# EAGLE design mainv2 (EAGLE 9.6.2)
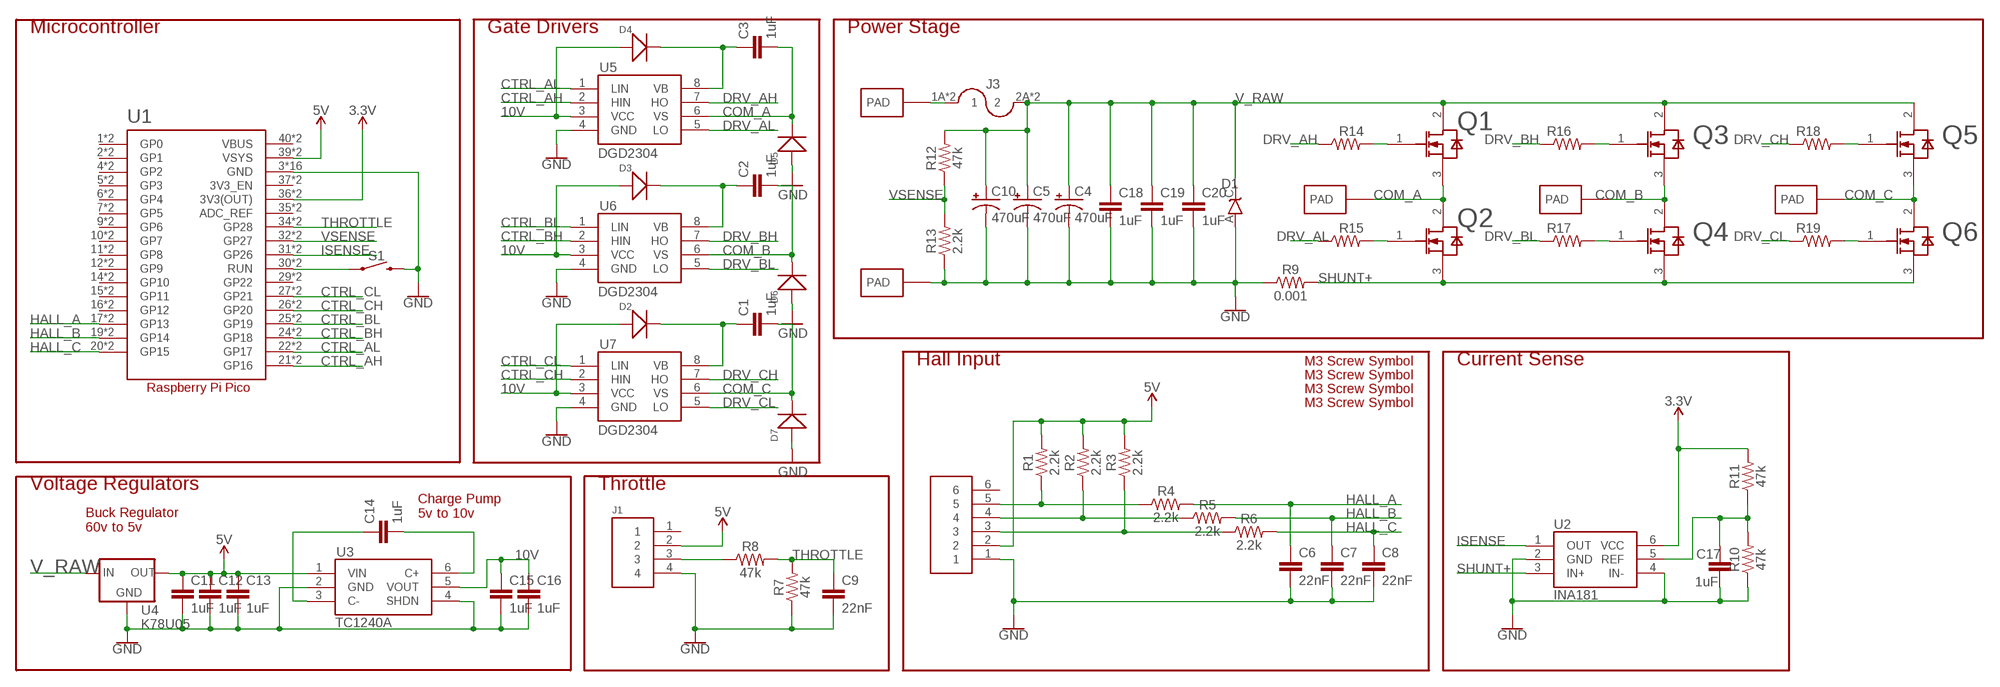
[diagram p0: schematic, sheet 1]

## Parts
C1  1uF  1.0UF-1206-50V-10%  [1206]
C2  1uF  1.0UF-1206-50V-10%  [1206]
C3  1uF  1.0UF-1206-50V-10%  [1206]
C4  470uF  1000UF-RADIAL-5MM-25V-20%  [CPOL-RADIAL-5MM-10MM]
C5  470uF  1000UF-RADIAL-5MM-25V-20%  [CPOL-RADIAL-5MM-10MM]
C6  22nF  1.0UF-1206-50V-10%  [1206]
C7  22nF  1.0UF-1206-50V-10%  [1206]
C8  22nF  1.0UF-1206-50V-10%  [1206]
C9  22nF  1.0UF-1206-50V-10%  [1206]
C10  470uF  1000UF-RADIAL-5MM-25V-20%  [CPOL-RADIAL-5MM-10MM]
C11  1uF  1.0UF-1206-50V-10%  [1206]
C12  1uF  1.0UF-1206-50V-10%  [1206]
C13  1uF  1.0UF-1206-50V-10%  [1206]
C14  1uF  1.0UF-1206-50V-10%  [1206]
C15  1uF  1.0UF-1206-50V-10%  [1206]
C16  1uF  1.0UF-1206-50V-10%  [1206]
C17  1uF  1.0UF-1206-50V-10%  [1206]
C18  1uF  1.0UF-1206-50V-10%  [1206]
C19  1uF  1.0UF-1206-50V-10%  [1206]
C20  1uF  1.0UF-1206-50V-10%  [1206]
D1  TVS  TVS_UNIDO-214AC  [DO-214AC]
D2  SMD-DIODE-100V-200MA(SOD-123)  [SOD-123]
D3  SMD-DIODE-100V-200MA(SOD-123)  [SOD-123]
D4  SMD-DIODE-100V-200MA(SOD-123)  [SOD-123]
D5  SMD-DIODE-100V-200MA(SOD-123)  [SOD-123]
D6  SMD-DIODE-100V-200MA(SOD-123)  [SOD-123]
D7  SMD-DIODE-100V-200MA(SOD-123)  [SOD-123]
J1  HEADER4VALULOK  [4PINVALULOK]
J2  HEADER6  [6PINVALULOK]
J3  FUSE  [AUTO_FUSE]
Q1  IRF135S203  [TO254P1524X508-4_3N]
Q2  IRF135S203  [TO254P1524X508-4_3N]
Q3  IRF135S203  [TO254P1524X508-4_3N]
Q4  IRF135S203  [TO254P1524X508-4_3N]
Q5  IRF135S203  [TO254P1524X508-4_3N]
Q6  IRF135S203  [TO254P1524X508-4_3N]
R1  2.2k  RESISTOR1206  [1206]
R2  2.2k  RESISTOR1206  [1206]
R3  2.2k  RESISTOR1206  [1206]
R4  2.2k  RESISTOR1206  [1206]
R5  2.2k  RESISTOR1206  [1206]
R6  2.2k  RESISTOR1206  [1206]
R7  47k  RESISTOR1206  [1206]
R8  47k  RESISTOR1206  [1206]
R9  0.001  RESISTOR  [R2512]
R10  47k  RESISTOR1206  [1206]
R11  47k  RESISTOR1206  [1206]
R12  47k  RESISTOR1206  [1206]
R13  2.2k  RESISTOR1206  [1206]
R14  R-US_R1206  [R1206]
R15  R-US_R1206  [R1206]
R16  R-US_R1206  [R1206]
R17  R-US_R1206  [R1206]
R18  R-US_R1206  [R1206]
R19  R-US_R1206  [R1206]
S1  MOMENTARY-SWITCH-SPST-PTH-6.0MM  [TACTILE_SWITCH_PTH_6.0MM]
U1  RASPBERRY_PICO-NO_DEBUG  [PICO-PKG-NO_DEBUG]
U2  INA181  [SOT23-6]
U3  TC1240A  [SOT23-6]
U4  K78U05  V_REG_78XX  [V78W_BACKWARDS]
U5  DGD2304  [SOIC8]
U6  DGD2304  [SOIC8]
U7  DGD2304  [SOIC8]
U$4  PAD  [PAD]
U$5  PAD  [PAD]
U$6  PAD  [PAD]
U$7  PAD  [PAD]
U$8  PAD  [PAD]
U$10  SCREW  [M3HOLE]
U$11  SCREW  [M3HOLE]
U$12  SCREW  [M3HOLE]
U$13  SCREW  [M3HOLE]

## Nets
3.3V: R11.2 U1.36(3V3(OUT)) U1.P$36(3V3(OUT)) U2.6(VCC)
5V: C11.1 C12.1 C13.1 J1.2 J2.2 R1.2 R2.2 R3.2 U1.39(VSYS) U1.P$39(VSYS) U3.1(VIN) U4.OUT
10V: C15.1 C16.1 D2.+ D3.+ D4.+ U3.5(VOUT) U5.3(VCC) U6.3(VCC) U7.3(VCC)
COM_A: C3.2 D5.- Q1.3(SOURCE) Q2.2(DRAIN) U5.6(VS) U$6.PAD
COM_B: C2.2 D6.- Q3.3(SOURCE) Q4.2(DRAIN) U6.6(VS) U$7.PAD
COM_C: C1.2 D7.- Q5.3(SOURCE) Q6.2(DRAIN) U7.6(VS) U$8.PAD
CTRL_AH: U1.21(GP16) U1.P$21(GP16) U5.2(HIN)
CTRL_AL: U1.22(GP17) U1.P$22(GP17) U5.1(LIN)
CTRL_BH: U1.24(GP18) U1.P$24(GP18) U6.2(HIN)
CTRL_BL: U1.25(GP19) U1.P$25(GP19) U6.1(LIN)
CTRL_CH: U1.26(GP20) U1.P$26(GP20) U7.2(HIN)
CTRL_CL: U1.27(GP21) U1.P$27(GP21) U7.1(LIN)
DRV_AH: R14.1 U5.7(HO)
DRV_AL: R15.1 U5.5(LO)
DRV_BH: R16.1 U6.7(HO)
DRV_BL: R17.1 U6.5(LO)
DRV_CH: R18.1 U7.7(HO)
DRV_CL: R19.1 U7.5(LO)
GND: C4.- C5.- C6.2 C7.2 C8.2 C9.2 C10.- C11.2 C12.2 C13.2 C15.2 C16.2 C17.2 C18.2 C19.2 C20.2 D1.A D5.+ D6.+ D7.+ J1.4 J2.1 R7.1 R9.1 R10.1 R13.1 S1.3 U1.3(GND) U1.8(GND) U1.13(GND) U1.18(GND) U1.23(GND) U1.28(GND) U1.33(GND) U1.38(GND) U1.P$3(GND) U1.P$8(GND) U1.P$13(GND) U1.P$18(GND) U1.P$23(GND) U1.P$28(GND) U1.P$33(GND) U1.P$38(GND) U2.2(GND) U2.4(IN-) U3.2(GND) U3.4(SHDN) U4.GND U5.4(GND) U6.4(GND) U7.4(GND) U$5.PAD
HALL_A: C6.1 R4.2 U1.17(GP13) U1.P$17(GP13)
HALL_B: C7.1 R5.2 U1.19(GP14) U1.P$19(GP14)
HALL_C: C8.1 R6.2 U1.20(GP15) U1.P$20(GP15)
ISENSE: U1.31(GP26) U1.P$31(GP26) U2.1(OUT)
N$1: C2.1 D3.- U6.8(VB)
N$2: J2.3 R3.1 R6.1
N$3: C3.1 D4.- U5.8(VB)
N$4: J2.4 R2.1 R5.1
N$5: Q3.1(GATE) R16.2
N$6: J2.5 R1.1 R4.1
N$7: J1.3 R8.1
N$8: C1.1 D2.- U7.8(VB)
N$9: S1.1 U1.30(RUN) U1.P$30(RUN)
N$10: C17.1 R10.2 R11.1 U2.5(REF)
N$11: Q5.1(GATE) R18.2
N$12: Q1.1(GATE) R14.2
N$13: Q2.1(GATE) R15.2
N$14: Q4.1(GATE) R17.2
N$15: Q6.1(GATE) R19.2
N$18: C14.1 U3.3(C-)
N$19: C14.2 U3.6(C+)
SHUNT+: Q2.3(SOURCE) Q4.3(SOURCE) Q6.3(SOURCE) R9.2 U2.3(IN+)
THROTTLE: C9.1 R7.2 R8.2 U1.34(GP28) U1.P$34(GP28)
V_PREFUSE: J3.1A J3.1B U$4.PAD
V_RAW: C4.+ C5.+ C10.+ C18.1 C19.1 C20.1 D1.C J3.2A J3.2B Q1.2(DRAIN) Q3.2(DRAIN) Q5.2(DRAIN) R12.2 U4.IN
VSENSE: R12.1 R13.2 U1.32(GP27) U1.P$32(GP27)
Unconnected: J1.1 J2.6 U1.1(GP0) U1.2(GP1) U1.4(GP2) U1.5(GP3) U1.6(GP4) U1.7(GP5) U1.9(GP6) U1.10(GP7) U1.11(GP8) U1.12(GP9) U1.14(GP10) U1.15(GP11) U1.16(GP12) U1.29(GP22) U1.35(ADC_REF) U1.37(3V3_EN) U1.P$1(GP0) U1.P$2(GP1) U1.P$4(GP2) U1.P$5(GP3) U1.P$6(GP4) U1.P$7(GP5) U1.P$9(GP6) U1.P$10(GP7) U1.P$11(GP8) U1.P$12(GP9) U1.P$14(GP10) U1.P$15(GP11) U1.P$16(GP12) U1.P$29(GP22) U1.P$35(ADC_REF) U1.P$37(3V3_EN)

## Notes on the sheet
- Microcontroller | Gate Drivers | Power Stage
- Hall Input | Current Sense
- Voltage Regulators | Throttle
- Charge Pump
  5v to 10v
- Buck Regulator
  60v to 5v

## Power pins joined to a net without a drawn wire
VBUS: U1.40(VBUS) U1.P$40(VBUS)

## Library data of the parts
C1-C3 C6-C9 C11-C20 = SparkFun-Capacitors:1.0UF: 1µF ceramic capacitors A capacitor is a passive two-terminal electrical component used to store electrical energy temporarily in an electric field.; PROD_ID: CAP-09822; VALUE: 1.0uF
C4 C5 C10 = SparkFun-Capacitors:1000UF: 1,000µF/1mF ceramic capacitors A capacitor is a passive two-terminal electrical component used to store electrical energy temporarily in an electric field. CAP-08070; PROD_ID: CAP-09538; VALUE: 1mF
D1 = 2018:TVS_UNI
D2-D7 = Seeed-Diode:SMD-DIODE-100V-200MA(SOD-123): 304010007; MPN: MMSD4148; VALUE: MMSD4148-sod123
J1 = Custom_old:HEADER4
J2 = Custom_old:HEADER6
J3 = Custom_old:FUSE
Q1-Q6 = IRF135S203:IRF135S203: IRF135S203 TO254P1524X508-4_3N Insulated-Gate Field-Effect Transistor (IGFET), N-Channel, Enhancement, Body Diode, Pin 1 Gate, 2 Drain, 3 Source, 3 Pins
R1-R8 R10-R13 = SparkFun-Resistors:RESISTOR: Generic Resistor Package
R9 = Custom_old:RESISTOR
R14-R19 = rcl:R-US_: RESISTOR, American symbol; SPICEPREFIX: R
S1 = SparkFun-Switches:MOMENTARY-SWITCH-SPST: Momentary Switch (Pushbutton) - SPST Normally-open (NO) SPST momentary switches (buttons, pushbuttons). Variants PTH-12MM - 12mm square, through-hole Momentary Pushbutton Switch - 12mm Square <https://www.sparkfun.com/products/9190> (COM-09190) PTH-6.0MM, PTH-6.0MM-KIT - 6.0mm square, through-hole Mini Pushbutton Switch <https://www.sparkfun.com/products/97> (COM-00097) KIT package intended for soldering kit's - only one side of pads' copper is exposed. PTH-RIGHT-ANGLE-KIT - Right-angle, through-hole Right Angle Tactile Button <https://www.sparkfun.com/products/10791> - Used on SparkFun BigTime Watch Kit <https://www.sparkfun.com/products/11734> SMD-12MM - 12mm square, surface-mount Tactile Button - SMD (12mm) <https://www.sparkfun.com/products/12993> (COM-12993) Used on SparkFun PicoBoard <https://www.sparkfun.com/products/11888> SMD-4.5MM - 4.5mm Square Trackball Switch Used on SparkFun Blackberry Trackballer Breakout <https://www.sparkfun.com/products/13169> SMD-4.6MMX2.8MM - 4.60mm x 2.80mm, surface mount Used on SparkFun SAMD21 Mini Breakout <https://www.sparkfun.com/products/13664> SMD-5.2MM, SMD-5.2-REDUNDANT - 5.2mm square, surface-mount Mini Pushbutton Switch - SMD <https://www.sparkfun.com/products/8720> (COM-08720) Used on Arduino Pro Mini <https://www.sparkfun.com/products/11114> REDUNDANT package connects both switch circuits together SMD-6.0X3.5MM - 6.0 x 3.5mm, surface mount Momentary Reset Switch SMD <https://www.sparkfun.com/products/8229> (COM-08229) SMD-6.2MM-TALL - 6.2mm square, surface mount Tactile Button - SMD (6mm) <https://www.sparkfun.com/products/12992> Used on SparkFun Digital Sandbox <https://www.sparkfun.com/products/12651> SMD-RIGHT-ANGLE - Right-angle, surface mount Used on SparkFun Block for Intel® Edison - Arduino <https://www.sparkfun.com/products/13036>; PROD_ID: SWCH-08441; SF_SKU: COM-00097
U1 = RpiPico:RASPBERRY_PICO-NO_DEBUG
U2 = Custom_old:INA181
U3 = Custom_old:TC1240A
U4 = 2018:V_REG_78XX: Voltage Regulator Standard 7805 5V regulator. IGO (Input Ground Output). Spark Fun Electronics SKU : COM-00107
U5-U7 = Custom_old:DGD2304
U$4-U$8 = Custom_old:PAD
U$10-U$13 = Custom_old:SCREW

## Net classes
0 default: clearance 0.205 mm

## Board
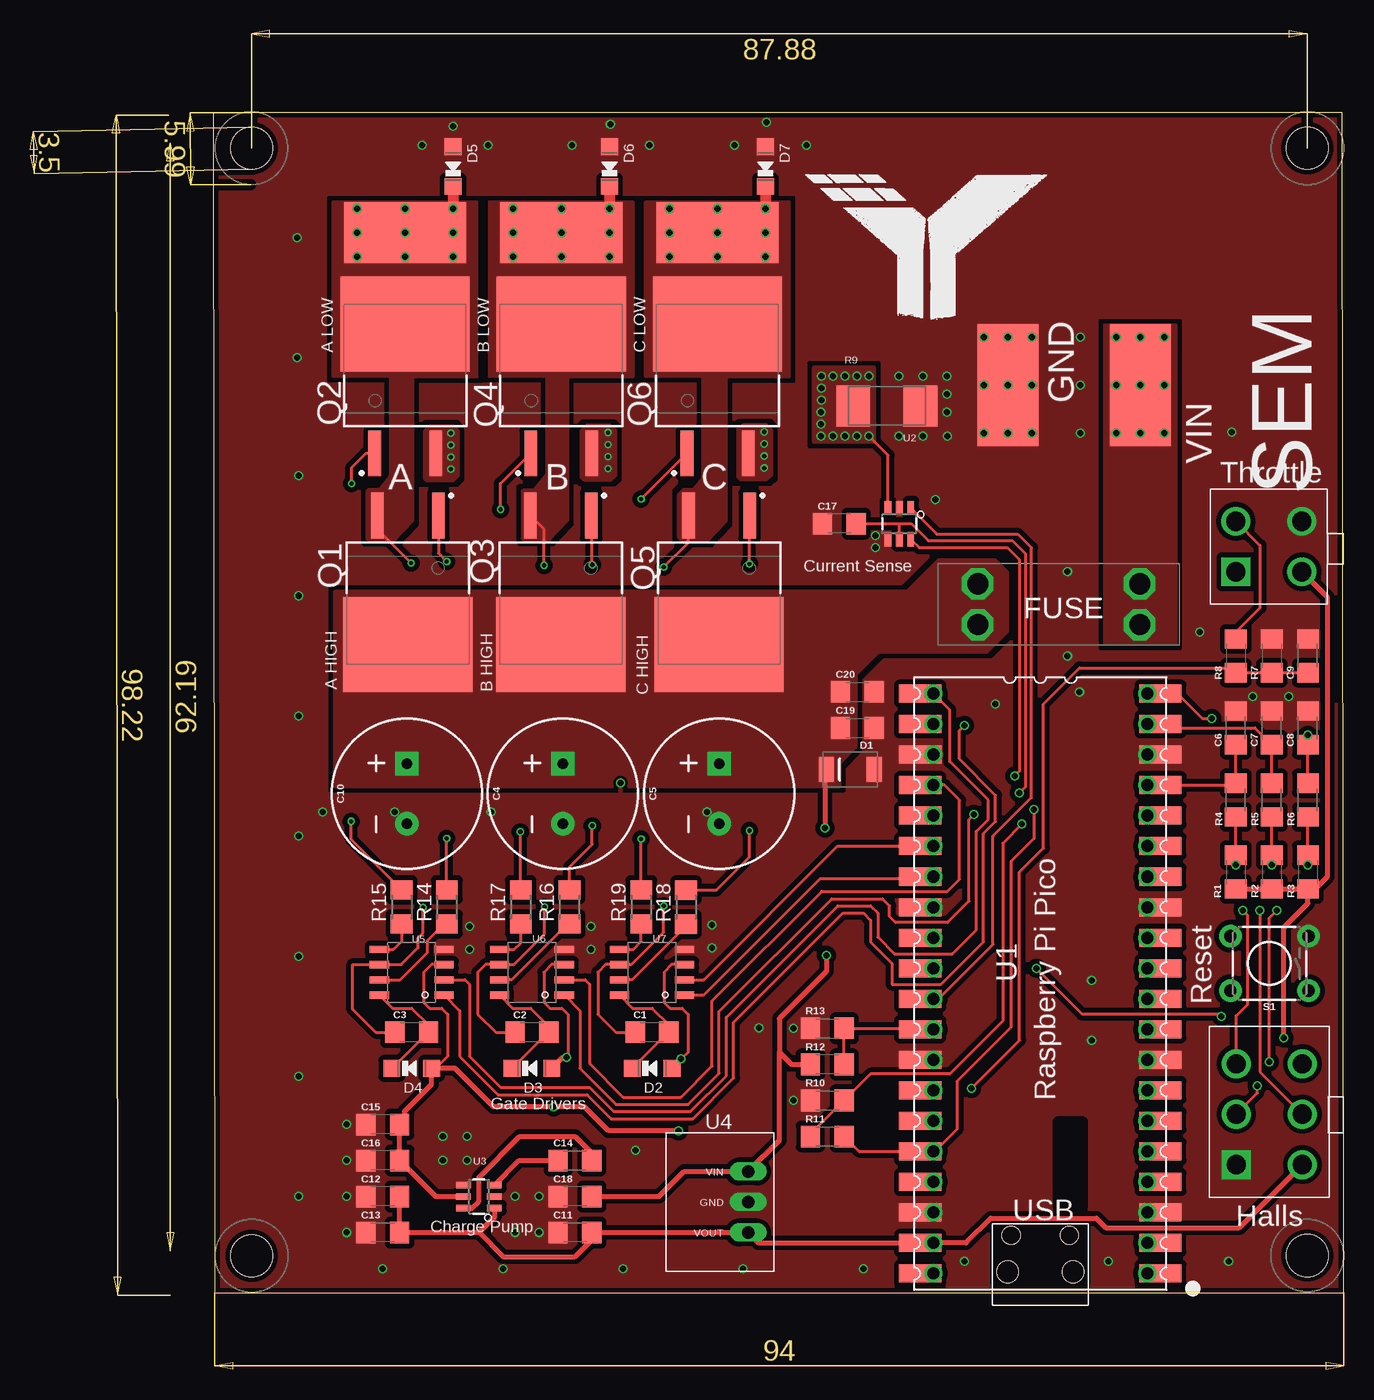
[diagram p1: board, top side]
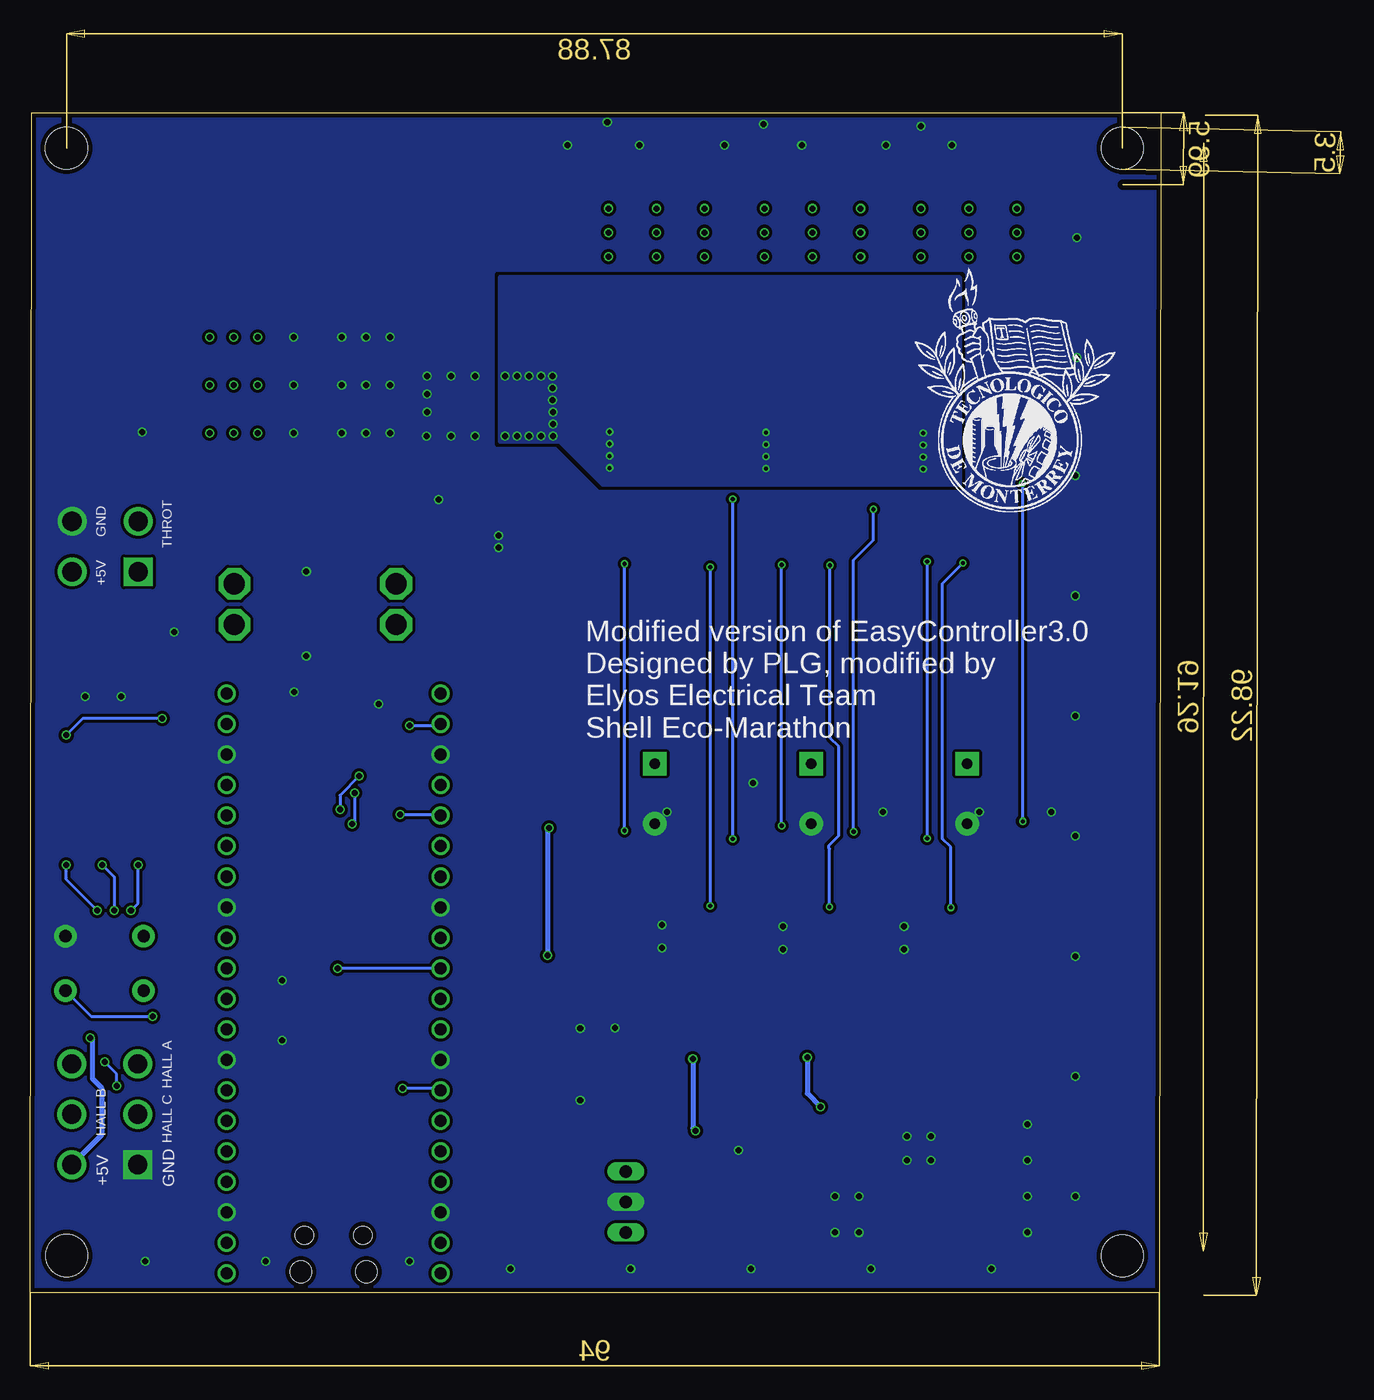
[diagram p2: board, bottom side, seen from below]

Size 94.12 x 98.22 mm. Coordinates in mm from the lower left corner, seen from the top.
Outline: 0.12,0 94.12,0 94,98.22 0,98.22 0.12,0
Copper layers (1*16): Top 0.035559375mm / dielectric 1.6mm / Bottom 0.035559375mm
Design rules "jlcpcb2layer *": minimum track width 6mil, minimum drill 10mil, track to track 5mil, track to pad 6mil, pad to pad 6mil, via to via 6mil, smd to smd 6mil, copper to edge 15mil, drill to drill 6mil, minimum pad ring 5mil, minimum via ring 5mil, stop-mask expansion 2.5mil, vias tented up to drill 25mil, thermal gap 10mil
Milling: area 129.4,61.5 to 134.8,61.6

### Footprints (pad centres in the part's own frame; a part is rotated, then mirrored left to right if it is on the bottom)
1206 = smd 1.6 x 1.8: 1 -1.4,0; 2 1.4,0
CPOL-RADIAL-5MM-10MM = drill 0.9 pad 1.93 square: + 2.5,0 | drill 0.9 pad 1.93: - -2.5,0
DO-214AC = smd 1.27 x 2.1: A 1.985,0; C -1.985,0
SOD-123 = smd 1.397 x 1.397: + -1.651,0; - 1.651,0
4PINVALULOK = drill 1.6 square: 1 0,5.5 | drill 1.6: 2 0,0; 3 4.2,5.5; 4 4.2,0
6PINVALULOK = drill 1.6 square: 1 -6.35,2.96 | drill 1.6: 2 -6.35,-2.54; 3 -2.15,2.96; 4 -2.15,-2.54; 5 2.05,2.96; 6 2.05,-2.54
AUTO_FUSE = drill 1.75 octagon: 1A 0,3.4; 1B 0,0; 2A 13.47,3.4; 2B 13.47,0
TO254P1524X508-4_3N = smd 3.8 x 1.05: 1 -5.375,2.54; 3 -5.375,-2.54 | smd 7.9 x 10.75: 2 5.375,0
R2512 = smd 2.8 x 3.4: 1 -2.8,0; 2 2.8,0
R1206 = smd 1.6 x 1.803: 1 -1.422,0; 2 1.422,0
TACTILE_SWITCH_PTH_6.0MM = drill 1.016 pad 1.88: 1 -3.251,2.261; 2 3.251,2.261; 3 -3.251,-2.261; 4 3.251,-2.261
PICO-PKG-NO_DEBUG = drill 1: 1 -7.62,25.4; 2 -7.62,22.86; 3 -7.62,20.32; 4 -7.62,17.78; 5 -7.62,15.24; 6 -7.62,12.7; 7 -7.62,10.16; 8 -7.62,7.62; 9 -7.62,5.08; 10 -7.62,2.54; 11 -7.62,0; 12 -7.62,-2.54; 13 -7.62,-5.08; 14 -7.62,-7.62; 15 -7.62,-10.16; 16 -7.62,-12.7; 17 -7.62,-15.24; 18 -7.62,-17.78; 19 -7.62,-20.32; 20 -7.62,-22.86; 21 10.16,-22.86; 22 10.16,-20.32; 23 10.16,-17.78; 24 10.16,-15.24; 25 10.16,-12.7; 26 10.16,-10.16; 27 10.16,-7.62; 28 10.16,-5.08; 29 10.16,-2.54; 30 10.16,0; 31 10.16,2.54; 32 10.16,5.08; 33 10.16,7.62; 34 10.16,10.16; 35 10.16,12.7; 36 10.16,15.24; 37 10.16,17.78; 38 10.16,20.32; 39 10.16,22.86; 40 10.16,25.4 | smd 3.5 x 1.5: P$1 -8.73,25.4; P$2 -8.73,22.86; P$3 -8.73,20.32; P$4 -8.73,17.78; P$5 -8.73,15.24; P$6 -8.73,12.7; P$7 -8.73,10.16; P$8 -8.73,7.62; P$9 -8.73,5.08; P$10 -8.73,2.54; P$11 -8.73,0; P$12 -8.73,-2.54; P$13 -8.73,-5.08; P$14 -8.73,-7.62; P$15 -8.73,-10.16; P$16 -8.73,-12.7; P$17 -8.73,-15.24; P$18 -8.73,-17.78; P$19 -8.73,-20.32; P$20 -8.73,-22.86; P$21 11.27,-22.86; P$22 11.27,-20.32; P$23 11.27,-17.78; P$24 11.27,-15.24; P$25 11.27,-12.7; P$26 11.27,-10.16; P$27 11.27,-7.62; P$28 11.27,-5.08; P$29 11.27,-2.54; P$30 11.27,0; P$31 11.27,2.54; P$32 11.27,5.08; P$33 11.27,7.62; P$34 11.27,10.16; P$35 11.27,12.7; P$36 11.27,15.24; P$37 11.27,17.78; P$38 11.27,20.32; P$39 11.27,22.86; P$40 11.27,25.4 | hole 1.8: -1.455,25.27; 3.995,25.27 | hole 1.5: -1.155,22.24; 3.695,22.24
SOT23-6 = smd 0.55 x 1.2: 1 -0.95,-1.3; 2 0,-1.3; 3 0.95,-1.3; 4 0.95,1.3; 5 0,1.3; 6 -0.95,1.3
V78W_BACKWARDS = drill 1.016 long: GND 0,-3.81; IN 2.54,-3.81; OUT -2.54,-3.81
SOIC8 = smd 1.6 x 0.6: 1 -2.7,1.905; 2 -2.7,0.635; 3 -2.7,-0.635; 4 -2.7,-1.905; 5 2.7,-1.905; 6 2.7,-0.635; 7 2.7,0.635; 8 2.7,1.905
PAD = smd 10.16 x 5.08: PAD 0,0
M3HOLE = hole 3.5: 0,0

### Placement (x,y rotation side)
C1  36.53,21.67 180 top
C2  26.53,21.67 180 top
C3  16.53,21.67 180 top
C4  29.11,41.53 90 top
C5  42.12,41.53 90 top
C6  85.12,47 90 top
C7  88.12,47 90 top
C8  91.12,47 90 top
C9  91.12,53 90 top
C10  16.13,41.53 90 top
C11  30.12,5 180 top
C12  14.12,8 180 top
C13  14.12,5 180 top
C14  30.12,11 0 top
C15  14.12,14 180 top
C16  14.12,11 180 top
C17  52.12,64 180 top
C18  30.12,8 180 top
C19  53.62,47 0 top
C20  53.62,50 0 top
D1  53.03,43.55 0 top
D2  36.53,18.67 180 top
D3  26.53,18.67 180 top
D4  16.53,18.67 180 top
D5  19.97,93.73 270 top
D6  33,93.73 270 top
D7  45.97,93.73 270 top
J1  90.62,60 90 top
J2  88.12,17 90 top
J3  77.12,59 180 top
Q1  16.21,59.31 270 top
Q2  15.98,75.24 90 top
Q3  28.94,59.31 270 top
Q4  28.98,75.24 90 top
Q5  42.11,59.31 270 top
Q6  41.98,75.24 90 top
R1  85.12,35 270 top
R2  88.12,35 270 top
R3  91.12,35 270 top
R4  85.12,41 90 top
R5  88.12,41 90 top
R6  91.12,41 90 top
R7  88.12,53 270 top
R8  85.12,53 270 top
R9  56.08,73.79 180 top
R10  51.12,16 0 top
R11  51.12,13 0 top
R12  51.12,19 180 top
R13  51.12,22 0 top
R14  19.45,32.11 90 top
R15  15.7,32.11 90 top
R16  29.66,32.11 90 top
R17  25.6,32.11 90 top
R18  39.37,32.08 90 top
R19  35.63,32.11 90 top
S1  87.92,27.4 180 top
U1  70.12,27 180 top
U2  57.12,64 180 top
U3  22.12,8 90 top
U4  40.72,7.54 90 top
U5  16.53,26.67 180 top
U6  26.53,26.67 180 top
U7  36.53,26.67 180 top
U$4  77.17,75.54 90 top
U$5  66.17,75.54 270 top
U$6  15.98,88.24 0 top
U$7  28.98,88.24 0 top
U$8  41.98,88.24 0 top
U$10  91.08,95.25 0 top
U$11  91.07,3.09 0 top
U$12  3.21,3.06 0 top
U$13  3.2,95.25 0 top

### Tracks (layer width: path | path; a pad name or v marks a point on that pad's centre or on a via)
3.3V  (via drill 0.5)
  Top 0.254: U2.6 58.77,62 66.12,62 67.12,61 67.12,43.4 v66.72,43 | v68.32,40.2 68.32,37.8 66.41,35.89 66.41,22.09 61.92,17.6 61.92,13.6 60.08,11.76 U1.36 | R11.2 53.76,11.76 U1.36 | U1.P$36 U1.36
  Bottom 0.254: v66.72,43 68.32,41.4 v68.32,40.2
5V  (via drill 0.5)
  Top 0.406: J2.2 85.41,5.4 74.32,5.4 73.52,6.2 64.72,6.2 62.66,4.14 U1.39 | R1.2 R2.2 R3.2 | R3.2 91.12,32.4 89.12,30.4 v89.12,21.2 | J1.2 92.72,57.9 92.72,34.6 91.72,33.6 R3.2 | C12.1 C13.1 22.12,5 | 22.12,5 24.12,3 30.12,3 31.52,4.4 C11.1 U4.OUT 45.4,4.14 U1.39 | U3.1 23.42,6.3 22.12,5 | U1.P$39 U1.39
  Bottom 0.406: J2.2 88.12,13.19 88.12,17 88.92,17.8 88.92,21.2 v89.12,21.2
10V  (via drill 0.5)
  Top 0.254: U6.3 28.17,27.3 27.53,26.67 27.53,24.17 28.03,23.67 29.03,23.67 29.53,23.17 29.53,19.67 v29.43,19.57 | U5.3 18.17,27.3 17.53,26.67 17.53,24.17 18.03,23.67 19.03,23.67 19.53,23.17 19.53,19.67 18.53,18.67 D4.+ | U7.3 38.17,27.3 37.53,26.67 37.53,24.17 38.03,23.67 39.03,23.67 39.53,23.17 39.53,20.02 v38.96,19.44
  Top 0.406: U3.5 18.52,8 C16.1 C15.1 15.93,14.41 15.93,15.07 18.18,17.32 D4.+ | D3.+ 29.08,19.57 v29.43,19.57 | 18.53,18.67 20.13,18.67 23.33,15.47 v28.33,15.47 30.93,15.47 32.93,13.47 v38.73,13.47 | D2.+ v38.96,19.44
  Bottom 0.406: v29.43,19.57 29.43,16.57 v28.33,15.47 | v38.96,19.44 38.96,13.69 v38.73,13.47
COM_A  (via drill 0.35, 0.5)
  Top 0.254: C3.2 13.53,21.67 11.62,23.58 11.62,27.3 U5.6 15.65,27.3 17.07,28.72 17.07,29.54 17.48,29.95 v17.48,32.05 | v16.47,60.72 13.67,63.52 Q1.3
  Top 0.914: D5.- 19.97,90.25 v19.98,90.24
  Bottom 0.254: v17.48,32.05 17.48,37.08 18.16,37.77 18.16,59.02 v16.47,60.72
  other vias: 15.98,88.24 11.98,90.24 11.98,88.24 11.98,86.24 15.98,86.24 15.98,90.24 19.98,88.24 19.98,86.24
  pour Top (isolate 0.406, rank 2, no thermals): 13.87,66.84 12.9,66.84 12.79,66.73 12.79,62.75 12.95,62.59 15.06,62.59 16.64,64.27 16.64,76.23 21.98,76.23 21.98,90.77 9.95,90.77 9.95,76.27 14.73,76.27 14.73,67.92
COM_B  (via drill 0.35, 0.5)
  Top 0.254: U6.6 22.67,27.3 22.03,26.67 22.03,23.17 23.53,21.67 C2.2 | U6.6 24.48,27.3 | U6.6 25.03,27.3 27.54,29.81 27.54,32.05 v27.58,32.09 | v27.54,60.53 27.54,63.55 Q3.3
  Top 0.8: 28.94,88.29 U$7.PAD
  Top 0.914: D6.- 33,90.26 v32.98,90.24
  Bottom 0.254: v27.58,32.09 27.58,36.94 27.63,36.99 27.63,37.22 26.8,38.04 26.8,45.45 27.54,46.18 v27.54,60.53
  other vias: 28.98,88.24 24.98,86.24 24.98,88.24 24.98,90.24 28.98,90.24 28.98,86.24 32.98,86.24 32.98,88.24
  pour Top (isolate 0.406, rank 2, no thermals): 26.71,66.79 25.81,66.79 25.7,66.68 25.7,62.79 25.86,62.63 27.97,62.63 29.55,64.32 29.55,76.22 29.85,76.24 34.98,76.24 34.98,90.77 22.95,90.77 22.95,76.27 27.73,76.27 27.73,68.08
COM_C  (via drill 0.35, 0.5)
  Top 0.152: Q5.3 39.56,64.67 39.56,64.59
  Top 0.254: C1.2 33.53,21.67 32.03,23.17 32.03,26.67 32.67,27.3 U7.6 34.82,27.3 37.5,29.99 v37.5,32.19 | v37.5,60.4 39.56,62.45 39.56,64.59
  Top 0.914: D7.- 45.97,90.25 v45.98,90.24
  Bottom 0.254: v37.5,32.19 v37.5,60.4
  other vias: 41.98,88.24 37.98,90.24 37.98,88.24 37.98,86.24 41.98,86.24 41.98,90.24 45.98,88.24 45.98,86.24
  pour Top (isolate 0.406, rank 2, no thermals): 40,66.84 39.13,66.84 38.7,66.41 38.7,62.88 39.04,62.54 41.15,62.54 42.73,64.22 42.73,76.23 42.85,76.24 47.98,76.24 47.98,90.77 47.97,90.78 35.95,90.78 35.95,76.27 40.73,76.27 40.73,67.76
CTRL_AH
  Top 0.254: U5.2 20.97,26.03 21.33,25.67 21.33,19.67 23.93,17.07 31.33,17.07 33.33,15.07 39.73,15.07 42.72,18.06 42.72,22.93 52,32.2 54.72,32.2 55.32,31.6 55.32,29.6 56.72,28.2 61.52,28.2 63.52,30.2 63.52,38.4 64.52,39.4 64.52,41 61.32,44.2 61.32,48.5 U1.21 U1.P$21
CTRL_AL  (via drill 0.5)
  Top 0.254: U5.1 20.53,23.46 20.53,19.67 23.73,16.47 31.13,16.47 33.13,14.47 39.93,14.47 43.32,17.86 43.32,22.5 52.42,31.6 54.12,31.6 54.72,31 54.72,29.2 56.52,27.4 56.52,25.66 60.59,25.66 64.12,29.2 64.12,38.2 65.12,39.2 65.12,41.4 62.12,44.4 62.12,46.8 v62.52,47.2 | U1.P$22 U1.22
  Bottom 0.254: v62.52,47.2 60.08,47.2 U1.22
CTRL_BH
  Top 0.254: U6.2 30.97,26.03 31.33,25.67 31.33,19.07 34.13,16.27 38.93,16.27 41.53,18.87 41.53,24.27 50.66,33.4 61.12,33.4 62.12,34.4 62.12,41 60.88,42.24 U1.24 U1.P$24
CTRL_BL  (via drill 0.5)
  Top 0.254: U6.1 30.53,23.46 30.53,18.67 33.53,15.67 39.53,15.67 42.12,18.26 42.12,23.41 51.49,32.78 55.72,32.78 56.31,32.19 56.31,31.3 56.81,30.8 61.12,30.8 62.92,32.6 62.92,39.4 v63.32,39.8 | U1.P$25 U1.25
  Bottom 0.254: v63.32,39.8 60.06,39.8 U1.25
CTRL_CH
  Top 0.254: U7.2 40.85,26.03 51.97,37.16 U1.P$26 U1.26
CTRL_CL
  Top 0.254: U7.1 40.85,24.76 50.52,34.44 58.67,34.44 U1.P$27 U1.27
DRV_AH
  Top 0.254: U5.7 15.58,26.03 17.84,28.3 17.84,29.31 19.2,30.66 R14.1
DRV_AL
  Top 0.254: R15.1 15.69,29.24 15.02,28.57 U5.5
DRV_BH
  Top 0.254: U6.7 24.86,26.03 29.51,30.68 R16.1
DRV_BL
  Top 0.254: U6.5 25.07,28.57 25.62,29.12 25.62,30.67 R17.1
DRV_CH
  Top 0.254: U7.7 34.87,26.03 39.37,30.53 R18.1
DRV_CL
  Top 0.254: U7.5 34.99,28.57 35.63,29.22 R19.1
GND  (via drill 0.5)
  other vias: 66.17,71.54 64.17,79.54 66.17,79.54 68.17,79.54 68.17,75.54 66.17,75.54 64.17,75.54 64.17,71.54 68.17,71.54 57.08,76.29 59.08,76.29 61.08,76.29 61.08,74.79 61.08,73.29 59.08,71.29 57.08,71.29 61.11,71.29 55.12,62 60.12,66 19.12,11 19.12,13 21.12,13 27.12,8 27.12,5 25.12,5 25.12,8 21.12,11 11.12,5 11.12,8 11.12,11 11.12,14 48.32,22 48.32,16 55.12,63 7.12,68 7.12,58 7.12,48 7.12,38 7.12,28 7.12,18 7.12,8 41.12,40 33.93,42.42 23.12,40 15.12,40 9.12,40 71.12,53 72.12,50 65.12,49 84.78,71.63 82.12,55 86.52,49.6 89.52,49.6 84.52,2.6 74.52,2.6 62.52,2.6 54.12,2 44.12,2 34.12,2 24.12,2 14.12,2 35.17,11.86 45.44,22.03 41.53,28.7 41.53,30.61 73.12,26 73.12,21 71.12,60 72.17,71.54 72.17,75.54 72.17,79.54 33.06,97.26 36.32,95.5 29.89,95.5 17.39,95.5 19.98,97.08 22.88,95.5 46.08,97.41 43.39,95.5 49.4,95.5 7,87.81 7,77.81 21.36,28.56 21.36,30.47 31.47,28.56 31.47,30.47
  pour Bottom (isolate 0.254, rank 5, no thermals): -8.88,101 -8.88,-2 96.12,-2 96.12,101
  pour Top (isolate 0.406, rank 5, no thermals): -7.88,100 -7.88,-1 95.12,-1 95.12,100
HALL_A
  Top 0.254: C6.1 R4.2 84.96,42.24 U1.P$17 U1.17
HALL_B
  Top 0.254: R5.2 C7.1 86.72,47 79.17,47 U1.P$19 U1.19
HALL_C  (via drill 0.5)
  Top 0.254: R6.2 C8.1 v91.12,46.4 | v83.12,47.8 82.32,47.8 80.26,49.86 U1.P$20 U1.20
  Bottom 0.254: v83.12,47.8 89.72,47.8 v91.12,46.4
ISENSE
  Top 0.254: U2.1 60.23,63.14 66.98,63.14 68.12,62 68.12,41.2 64.92,38 64.92,29 60.38,24.46 U1.P$31 U1.31
N$1
  Top 0.254: U6.8 24.93,23.67 26.43,23.67 27.93,22.17 C2.1 27.88,21.67 D3.-
N$2  (via drill 0.5)
  Top 0.254: J2.3 86.92,16.61 v86.92,17.2 | v87.92,19.2 87.92,31.2 v88.52,31.8 | v91.12,35.6 R3.1 R6.1
  Bottom 0.254: v86.92,17.2 86.92,18.2 v87.92,19.2 | v88.52,31.8 91.12,34.4 v91.12,35.6
N$3
  Top 0.254: U5.8 14.93,23.67 16.53,23.67 17.93,22.27 C3.1 17.88,21.67 D4.-
N$4  (via drill 0.5)
  Top 0.254: v88.12,35.6 R2.1 R5.1 | v87.12,31.8 87.12,18.39 J2.4
  Bottom 0.254: v88.12,35.6 87.12,34.6 v87.12,31.8
N$5  (via drill 0.35)
  Top 0.254: R16.2 29.66,35.41 31.56,37.31 v31.56,38.86 | v31.56,60.58 31.56,64.6 Q3.1
  Bottom 0.254: v31.56,38.86 v31.56,60.58 | v31.56,60.58
N$6  (via drill 0.5)
  Top 0.254: J2.5 85.16,23.04 86.12,24 86.12,31.4 v85.72,31.8 | v85.12,35.6 R1.1 R4.1
  Bottom 0.254: v85.72,31.8 85.12,32.4 v85.12,35.6
N$7
  Top 0.254: J1.3 87.12,62.2 87.12,57 85.12,55 R8.1
N$8
  Top 0.254: U7.8 34.93,23.67 36.53,23.67 37.93,22.27 C1.1 37.88,21.67 D2.-
N$9  (via drill 0.5)
  Top 0.254: v68.52,27 72.32,23.2 83.72,23.2 v83.92,23 | U1.P$30 U1.30
  Bottom 0.254: S1.1 89.03,23 v83.92,23 | U1.30 v68.52,27
N$10  (via drill 0.5)
  Top 0.254: C17.1 57.12,64 | U2.5 57.12,64 | 57.12,64 58.12,64 59.53,62.59 66.53,62.59 67.62,61.5 67.62,42.1 v67.12,41.6 | v67.32,39 65.72,37.4 65.72,22.6 61.32,18.2 54.72,18.2 R10.2 49.72,13.2 R11.1
  Bottom 0.254: v67.12,41.6 67.12,39.2 v67.32,39
N$11  (via drill 0.35)
  Top 0.254: R18.2 41.88,33.5 44.64,36.26 v44.64,38.45 | v44.64,60.67 44.65,60.69 Q5.1
  Bottom 0.254: v44.64,38.45 v44.64,60.67 | v44.64,60.67
N$12  (via drill 0.35)
  Top 0.254: R14.2 19.45,37.8 v19.44,37.81 | Q1.1 18.75,61.54 v19.44,60.85
  Bottom 0.254: v19.44,37.81 v19.44,60.85
N$13  (via drill 0.35)
  Top 0.254: R15.2 11.49,37.73 v11.49,39.23 | v11.53,67.35 11.53,68.67 12.73,69.86 Q2.1
  Bottom 0.254: v11.49,39.23 11.49,67.3 v11.53,67.35
N$14  (via drill 0.35)
  Top 0.254: R17.2 25.6,38.33 v25.57,38.36 | v23.93,65.2 23.93,67.34 Q4.1
  Bottom 0.254: v25.57,38.36 25.57,60.99 23.93,62.64 v23.93,65.2
N$15  (via drill 0.35)
  Top 0.254: R19.2 v35.63,37.76 v35.63,37.77 | v35.63,66.05 Q6.1 | v35.63,37.77
  Bottom 0.254: v35.63,37.77 35.63,66.02 | 35.63,66.02 | 35.63,66.02 v35.63,66.05 | v35.63,66.05
N$18
  Top 0.406: U3.3 25.47,11 C14.1
N$19
  Top 0.406: U3.6 20.87,7 21.52,7 22.12,7.6 22.12,9.6 25.52,13 30.12,13 31.52,11.6 C14.2
SHUNT+  (via drill 0.35, 0.5)
  Top 0.254: U2.3 56.17,69.7 v54.58,71.3
  other vias: 50.62,75.29 50.62,74.29 50.58,73.29 50.58,72.29 50.58,71.29 51.58,71.29 52.58,71.29 53.58,71.29 50.62,76.29 51.58,76.29 52.58,76.29 53.58,76.29 54.58,76.29 19.78,71.55 19.78,70.55 19.78,69.55 19.78,68.55 32.88,71.59 32.88,70.59 32.88,69.59 32.88,68.59 45.88,71.64 45.88,70.64 45.88,69.64 45.88,68.64
  pour Top (isolate 0.406, no thermals): 49.94,77.02 49.94,70.79 55.08,70.79 55.08,77.02
  pour Top (no thermals): 19.96,67.54 17.78,67.54 17.58,67.75 17.58,71.75 17.98,72.15 19.98,72.15 20.38,71.75 20.38,67.95
  pour Top (no thermals): 33.07,67.59 30.88,67.59 30.68,67.79 30.68,71.79 31.08,72.19 33.08,72.19 33.48,71.79 33.48,67.97
  pour Top (no thermals): 46.08,67.64 43.88,67.64 43.68,67.84 43.68,71.84 44.08,72.24 46.08,72.24 46.45,71.83 46.45,68.02
  pour Bottom: 55.08,84.55 55.08,70.79 50.08,70.79 46.51,67.23 16.64,67.23 16.64,84.49 16.71,84.55
THROTTLE  (via drill 0.5)
  Top 0.254: C9.1 R7.2 R8.2 84.72,52 72.12,52 69.12,49 69.12,37 67.12,35 67.12,21 v63.12,17 | U1.P$34 U1.34
  Bottom 0.254: U1.34 60.12,17 v63.12,17
V_PREFUSE  (via drill 0.5)
  other vias: 77.17,75.54 75.17,79.54 75.17,75.54 75.17,71.54 77.17,71.54 79.17,71.54 79.17,75.54 79.17,79.54 77.17,79.54
  pour Top (isolate 0.406, no thermals): 74.17,80.54 74.17,54 80.17,54 80.17,80.54
V_RAW  (via drill 0.5)
  Top 0.406: v51.06,28.07 51.06,26.74 47.12,22.8 47.12,20 | 47.12,20 48.12,19 R12.2 | D1.C 50.92,43.42 v50.92,38.69 | 47.12,20 47.12,12.67 U4.IN 39.2,10.08 37.12,8 C18.1
  Bottom 0.406: v50.92,38.69 51.06,38.55 v51.06,28.07
  pour Top (no thermals): 10.12,58.38 57.73,58.38 60.35,61 65.12,61 66.12,60 66.12,55 64.4,53.27 55.4,53.27 53.52,51.4 53.52,45.4 52.12,44 52.12,42.1 10.12,42.1
VBUS
  Top 0.254: U1.P$40 U1.40
VSENSE
  Top 0.254: R12.1 R13.2 59.88,22 U1.32 U1.P$32

### Text on the board
tPlace: SEM | A LOW | B LOW | C LOW | GND | VIN | A | B | C | Throttle | Current Sense | FUSE | A HIGH | B HIGH | C HIGH | Reset | Raspberry Pi Pico | Gate Drivers | Halls | USB | Charge Pump
bPlace: THROT | GND | +5V | Modified version of EasyController3.0 / Designed by PLG, modified by / Elyos Electrical Team / Shell Eco-Marathon | HALL A | HALL B | HALL C | GND | +5V | C:/Users/fernando/Pictures/Escul/logotecbitmapMIRROR.bmp